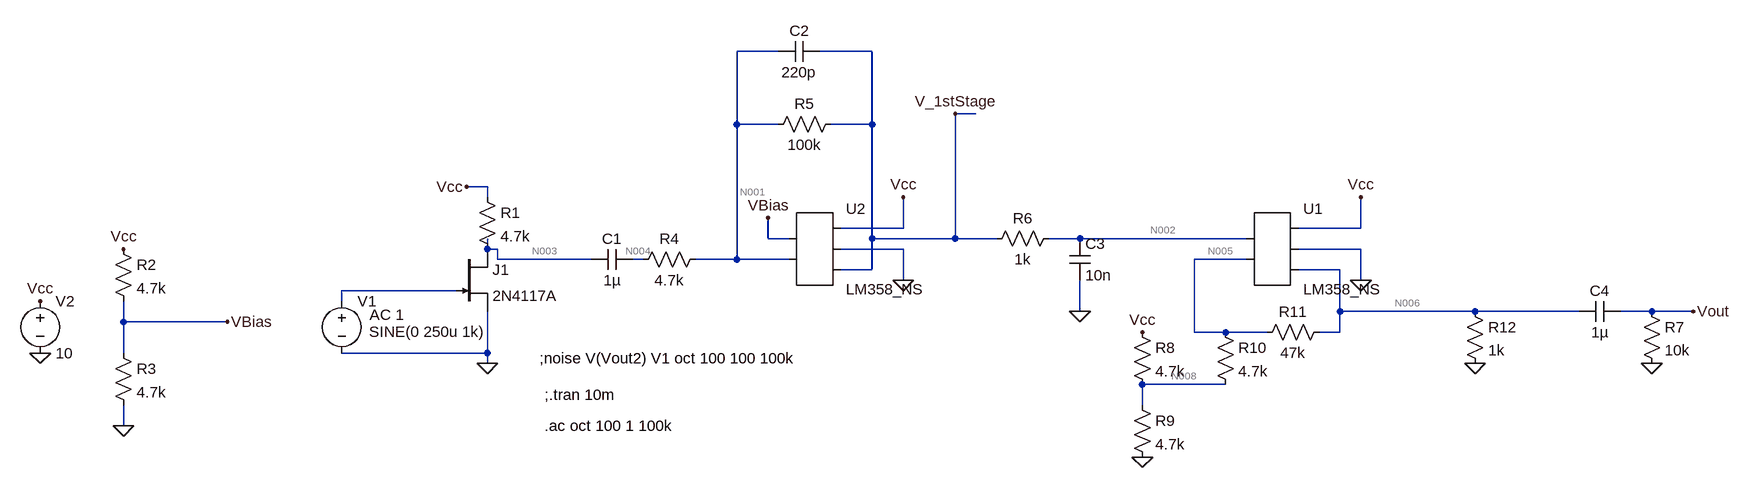
[diagram p0: schematic Building_Preamp_4_LM358_SecondStage.asc]
* Building_Preamp_4_LM358_SecondStage.asc
V1 N007 0 SINE(0 250u 1k) AC 1
V2 Vcc 0 10
C1 N004 N003 1µ
J1 N003 N007 0 2N4117A
R2 Vcc VBias 4.7k
R3 VBias 0 4.7k
* U2: LM358_NS (symbol AutoGenerated\LM358_NS not available, pins judged from their places): pin1=VBias pin2=N001 pin3=Vcc pin4=0 pin5=V_1stStage
R4 N001 N004 4.7k
R5 V_1stStage N001 100k
C2 V_1stStage N001 220p
* U1: LM358_NS (symbol AutoGenerated\LM358_NS not available, pins judged from their places): pin1=N002 pin2=N005 pin3=Vcc pin4=0 pin5=N006
R6 N002 V_1stStage 1k
C3 N002 0 10n
C4 Vout N006 1µ
R7 Vout 0 10k
R8 Vcc N008 4.7k
R9 N008 0 4.7k
R10 N005 N008 4.7k
R11 N006 N005 47k
R12 N006 0 1k
R1 Vcc N003 4.7k
.model NJF NJF
.model PJF PJF
.lib standard.jft
;.tran 10m
;noise V(Vout2) V1 oct 100 100 100k
.ac oct 100 1 100k
.backanno
.end

* Results of the author's LTspice run, read from the files saved beside the schematic
* Operating Point, zero values left out:
*   V(vcc) = 10 V
*   V(n004) = 5.002 V
*   V(n003) = 5.986 V
*   V(vbias) = 5 V
*   V(n001) = 5.002 V
*   V(v_1ststage) = 4.998 V
*   V(n005) = 5 V
*   V(n002) = 4.998 V
*   V(n006) = 5.001 V
*   V(n008) = 5 V
*   Id(J1) = 854.1 µA
*   Ig(J1) = -6.093 pA
*   Is(J1) = -854.1 µA
*   I(R1) = 854.1 µA
*   I(R12) = 5.001 mA
*   I(R11) = 15.37 nA
*   I(R10) = 53.33 nA
*   I(R9) = 1.064 mA
*   I(R8) = 1.064 mA
*   I(R6) = 51.96 nA
*   I(R5) = -37.96 nA
*   I(R3) = 1.064 mA
*   I(R2) = 1.064 mA
*   I(V2) = -7.936 mA
*   I(V1) = 6.093 pA
*   Ix(u2:1) = -51.96 nA
*   Ix(u2:2) = -37.96 nA
*   Ix(u2:99) = -4.781 µA
*   Ix(u2:50) = 4.781 µA
*   Ix(u2:28) = 89.91 nA
*   Ix(u1:1) = -51.96 nA
*   Ix(u1:2) = -37.96 nA
*   Ix(u1:99) = 4.959 mA
*   Ix(u1:50) = 41.75 µA
*   Ix(u1:28) = -5.001 mA
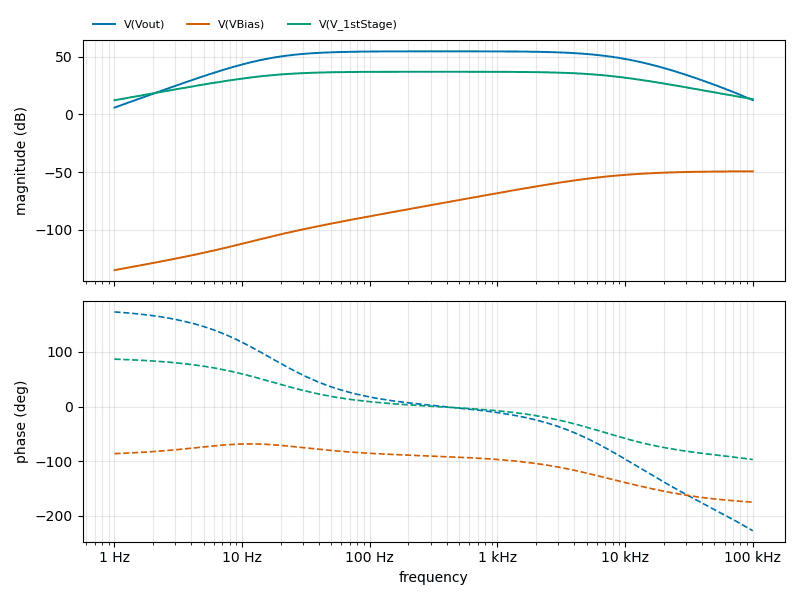
[diagram p1: AC Analysis of Building_Preamp_4_LM358_SecondStage.asc, plotted from the saved traces]
* AC Analysis, 1 run:
*   V(Vout): 5.78 dB at 1 Hz, 12.22 dB at 100 kHz, peak 54.51 dB at 380 Hz, 3 dB below the peak at 25.55 Hz and 5.829 kHz
*   V(VBias): -134.89 dB at 1 Hz, -49.33 dB at 100 kHz, peak -49.33 dB at 100 kHz, 3 dB below the peak at 10.2 kHz
*   V(V_1stStage): 12.14 dB at 1 Hz, 13.07 dB at 100 kHz, peak 36.83 dB at 337.8 Hz, 3 dB below the peak at 17.09 Hz and 6.659 kHz